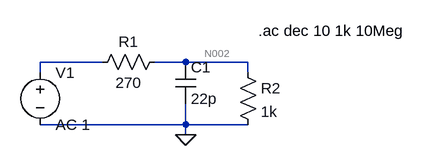
[diagram p0: schematic RC Filter for ADC.asc]
RC Filter for ADC.asc, the LTspice schematic file:
Version 4
SHEET 1 880 680
WIRE -16 176 -112 176
WIRE 112 176 64 176
WIRE 208 176 112 176
WIRE -112 192 -112 176
WIRE 208 192 208 176
WIRE 112 272 112 240
WIRE 112 272 -112 272
WIRE 208 272 112 272
WIRE 112 288 112 272
FLAG 112 288 0
SYMBOL cap 96 176 R0
SYMATTR InstName C1
SYMATTR Value 22p
SYMBOL res 80 160 R90
WINDOW 0 0 56 VBottom 2
WINDOW 3 32 56 VTop 2
SYMATTR InstName R1
SYMATTR Value 270
SYMBOL voltage -112 176 R0
WINDOW 123 0 0 Left 0
WINDOW 39 0 0 Left 0
SYMATTR InstName V1
SYMATTR Value AC 1
SYMBOL res 192 176 R0
SYMATTR InstName R2
SYMATTR Value 1k
TEXT 224 128 Left 2 !.ac dec 10 1k 10Meg

The netlist it stands for:
* RC Filter for ADC.asc
C1 N002 0 22p
R1 N002 N001 270
V1 N001 0 AC 1
R2 N002 0 1k
.ac dec 10 1k 10Meg
.backanno
.end

* Results of the author's LTspice run, read from the files saved beside the schematic
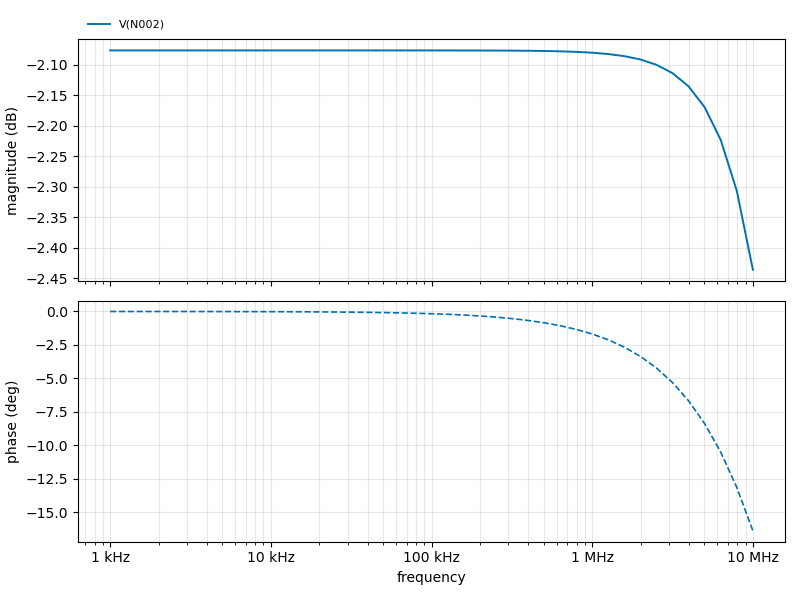
[diagram p1: AC Analysis of RC Filter for ADC.asc, plotted from the saved traces]
* AC Analysis, 1 run:
*   V(N002): -2.08 dB at 1 kHz, -2.44 dB at 10 MHz, peak -2.08 dB at 1 kHz